# Altium schematic sheet EngineLines.SchDoc
size A; SheetNumber: 3; SheetTotal: 10
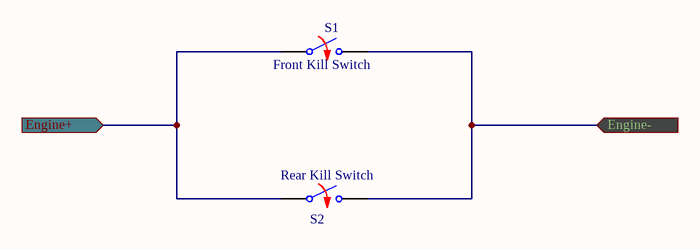
[diagram p0: EngineLines.SchDoc]

## Parts
S1  Front Kill Switch
S2  Rear Kill Switch

## Ports
Engine+ (in), Engine- (in)

## Nets
Engine+: S1.1 S2.1 ; port Engine+
Engine-: S1.2 S2.2 ; port Engine-

## Library data of the parts
S1 S2 = SW NO: Switch Normally Opened; closed: 0; Rclosed: 1m; Ropen: 1Meg; SimulationGenericComponent: True